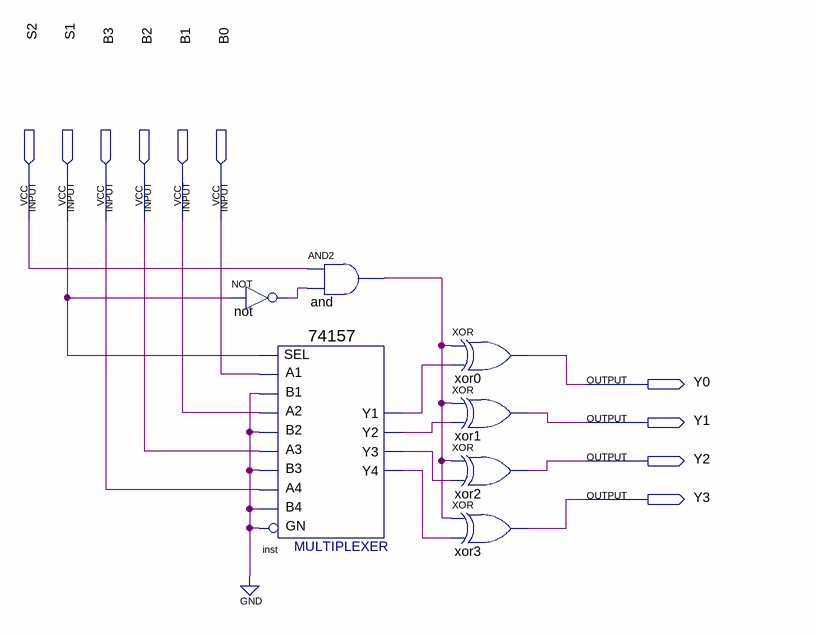
[diagram p0: schematic sheet]
// Quartus schematic ArithcircuitLogic4bits.bdf as structural Verilog: 7 symbols, 10 pins
module ArithcircuitLogic4bits (
  input  S2,
  input  S1,
  input  B3,
  input  B2,
  input  B1,
  input  B0,
  output Y0,
  output Y1,
  output Y2,
  output Y3
);

  wire and_out, inst_y1, inst_y2, inst_y3, inst_y4, not_out;

  not \not  (not_out, S1);
  \74157  inst (
    .A1(B0), .B1(1'b0), .SEL(S1), .B2(1'b0), .A3(B2), .B3(1'b0), .A2(B1), .B4(1'b0), .GN(1'b0), .A4(B3),
    .Y2(inst_y2), .Y1(inst_y1), .Y4(inst_y4), .Y3(inst_y3));
  and \and  (and_out, S2, not_out);
  xor xor0 (Y0, and_out, inst_y1);
  xor xor1 (Y1, and_out, inst_y2);
  xor xor2 (Y2, and_out, inst_y3);
  xor xor3 (Y3, and_out, inst_y4);
endmodule
